# EAGLE design adcdac (EAGLE 6.4)
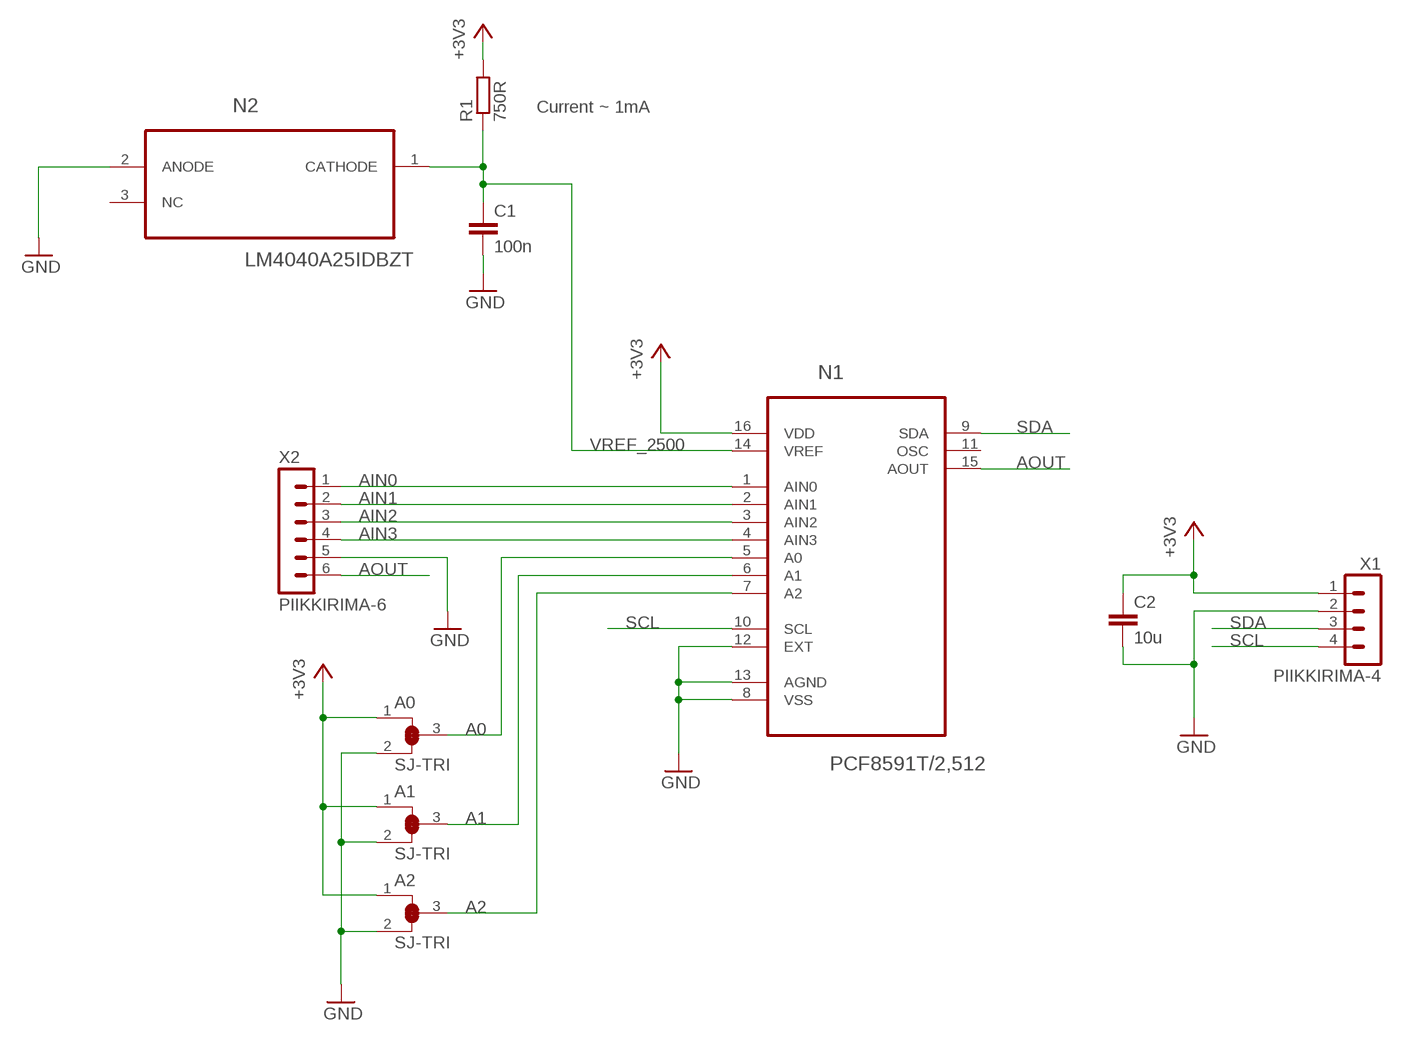
[diagram p0: schematic, sheet 1]

## Parts
A0  SJ-TRI  [SJ-SMALL-TRI]
A1  SJ-TRI  [SJ-SMALL-TRI]
A2  SJ-TRI  [SJ-SMALL-TRI]
C1  100n  C-EUC0603  [C0603]
C2  10u  C-EUC0805  [C0805]
N1  PCF8591T/2,512  [SOIC127P1032X265-16N]
N2  LM4040A25IDBZT  [SOT95P237X112-3N]
R1  750R  R-EU_R0603  [R0603]
X1  PIIKKIRIMA-4  [PIIKKIRIMA-4]
X2  PIIKKIRIMA-6  [PIIKKIRIMA-6]

## Nets
+3V3: A0.1 A1.1 A2.1 C2.1 N1.16(VDD) R1.2 X1.1
A0: A0.3 N1.5(A0)
A1: A1.3 N1.6(A1)
A2: A2.3 N1.7(A2)
AIN0: N1.1(AIN0) X2.1
AIN1: N1.2(AIN1) X2.2
AIN2: N1.3(AIN2) X2.3
AIN3: N1.4(AIN3) X2.4
AOUT: N1.15(AOUT) X2.6
GND: A0.2 A1.2 A2.2 C1.2 C2.2 N1.8(VSS) N1.12(EXT) N1.13(AGND) N2.2(ANODE) X1.2 X2.5
SCL: N1.10(SCL) X1.4
SDA: N1.9(SDA) X1.3
VREF_2500: C1.1 N1.14(VREF) N2.1(CATHODE) R1.1
Unconnected: N1.11(OSC) N2.3(NC)

## Notes on the sheet
- Current ~ 1mA

## Library data of the parts
A0 A1 A2 = OMAT_IC:SJ-TRI
C1 C2 = rcl:C-EU: CAPACITOR, European symbol
N1 = NXP_By_element14_Batch_1:PCF8591T/2,512: 8-bit A/D and D/A converter; MPN: PCF8591T/2,512; OC_FARNELL: 1826767; OC_NEWARK: 70R6911; PACKAGE: SO16; SUPPLIER: NXP
N2 = Texas Instruments_By_element14_Batch_1:LM4040A25IDBZT: PRECISION MICROPOWER SHUNT VOLTAGE REFERENCE; MPN: LM4040A25IDBZT; OC_FARNELL: 1652303; OC_NEWARK: 53K9324; PACKAGE: 3-SOT-23; SUPPLIER: TEXAS INSTRUMENTS
R1 = rcl:R-EU_: RESISTOR, European symbol
X1 = OMAT_IC:PIIKKIRIMA-4
X2 = OMAT_IC:PIIKKIRIMA-6

## Board
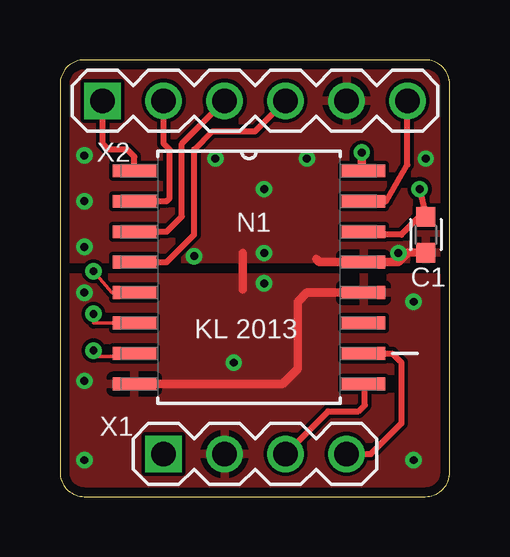
[diagram p1: board, top side]
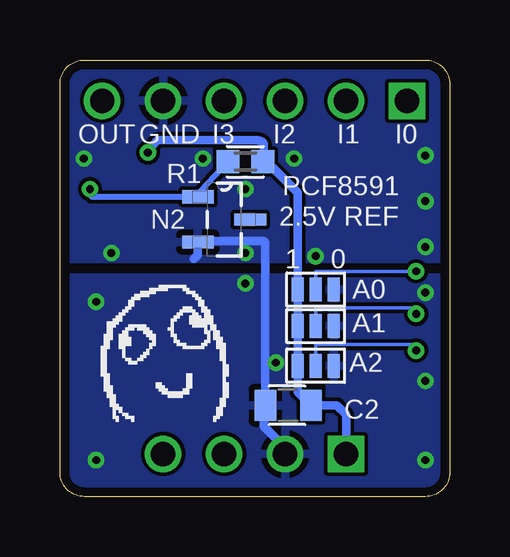
[diagram p2: board, bottom side, seen from below]

Size 16.24 x 18.21 mm. Coordinates in mm from the lower left corner, seen from the top.
Outline: 0,17.2 0,1.02 arc90 1.02,0 15.22,0 arc90 16.24,1.02 16.24,17.2 arc90 15.22,18.21 1.02,18.21 arc90 0,17.2
Copper layers (1*16): Top 0.0356mm / dielectric 1.5011mm / Bottom 0.0356mm
Design rules "LaenPCBOrder": minimum track width 6mil, minimum drill 13mil, track to track 6mil, track to pad 6mil, pad to pad 6mil, via to via 6mil, smd to smd 6mil, copper to edge 15mil, drill to drill 6mil, minimum pad ring 7mil, minimum via ring 7mil, stop-mask expansion 4mil, vias tented up to drill 0mil, thermal gap 10mil

### Footprints (pad centres in the part's own frame; a part is rotated, then mirrored left to right if it is on the bottom)
SJ-SMALL-TRI = smd 0.5 x 1: 1 -0.75,0; 2 0.75,0; 3 0,0
C0603 = smd 0.8 x 0.8: 1 -0.75,0; 2 0.75,0
C0805 = smd 0.9 x 1.3: 1 -0.95,0; 2 0.95,0
SOIC127P1032X265-16N = smd 1.803 x 0.533: 1 -4.775,4.445; 2 -4.775,3.175; 3 -4.775,1.905; 4 -4.775,0.635; 5 -4.775,-0.635; 6 -4.775,-1.905; 7 -4.775,-3.175; 8 -4.775,-4.445; 9 4.775,-4.445; 10 4.775,-3.175; 11 4.775,-1.905; 12 4.775,-0.635; 13 4.775,0.635; 14 4.775,1.905; 15 4.775,3.175; 16 4.775,4.445
SOT95P237X112-3N = smd 1.321 x 0.559: 1 -1.092,0.94; 2 -1.092,-0.94 | smd 1.321 x 0.508: 3 1.092,0
R0603 = smd 0.95 x 0.95: 1 -0.725,0; 2 0.725,0
PIIKKIRIMA-4 = drill 1.016 square: 1 0,0 | drill 1.016: 2 2.54,0; 3 5.08,0; 4 7.62,0
PIIKKIRIMA-6 = drill 1.016 square: 1 0,0 | drill 1.016: 2 2.54,0; 3 5.08,0; 4 7.62,0; 5 10.16,0; 6 12.7,0

### Placement (x,y rotation side)
A0  5.59,8.64 0 bottom
A1  5.59,7.11 0 bottom
A2  5.59,5.46 0 bottom
C1  15.24,10.92 270 top
C2  6.73,3.81 180 bottom
N1  7.87,9.14 0 top
N2  9.4,11.56 0 bottom
R1  8.51,13.97 0 bottom
U$1  [DAFUG]  11.68,5.71 0 bottom
X1  4.32,1.78 0 top
X2  1.78,16.51 0 top

### Tracks (layer width: path | path; a pad name or v marks a point on that pad's centre or on a via)
+3V3  (via drill 0.33)
  Top 0.356: v12.57,14.35 12.57,13.66 N1.16
  Bottom 0.356: X1.1 4.32,3.43 4.7,3.81 C2.1 6.34,4.37 A2.1 A1.1 A0.1 6.34,12.69 7.62,13.97 R1.2 7.75,14.01 7.75,14.73 7.78,14.77 arc-45 8,14.86 12.19,14.86 12.32,14.73 v12.57,14.35
A0  (via drill 0.33)
  Top 0.152: v1.4,9.4 2.16,8.51 N1.5
  Bottom 0.152: A0.3 5.59,9.4 v1.4,9.4
A1  (via drill 0.33)
  Top 0.152: N1.6 1.4,7.24 v1.4,7.62
  Bottom 0.152: v1.4,7.62 1.52,7.87 5.59,7.87 A1.3
A2  (via drill 0.33)
  Top 0.152: v1.4,6.1 1.4,5.84 2.97,5.84 N1.7
  Bottom 0.152: A2.3 5.59,6.35 1.4,6.35 v1.4,6.1
AIN0
  Top 0.254: N1.1 3.1,14.17 2.79,14.48 2.03,14.48 1.78,14.73 X2.1
AIN1
  Top 0.254: N1.2 4.45,12.32 4.57,12.45 4.57,14.48 4.32,14.73 X2.2
AIN2
  Top 0.254: N1.3 4.45,11.05 5.08,11.68 5.08,14.73 X2.3
AIN3
  Top 0.254: N1.4 4.45,9.78 5.59,10.92 5.59,14.48 6.35,15.24 8.13,15.24 X2.4
AOUT
  Top 0.254: N1.15 13.59,12.32 14.48,13.84 X2.6
GND  (via drill 0.33)
  Top 0.356: N1.12 10.29,8.51 9.91,8.13 9.91,5.33 9.27,4.7 N1.8 | C1.2 14.49,10.17 14.1,9.78 N1.13 10.79,9.78 10.67,9.91 | 7.62,10.16 7.62,8.64
  Bottom 0.356: X1.2 6.86,2.03 7.75,2.92 7.75,3.74 C2.2 7.68,10.6 7.75,10.67 10.41,10.67 N2.2 10.49,10.08 10.67,9.91
  other vias: 8.51,8.89 8.51,10.16 1.02,10.41 1.02,12.32 1.02,14.22 15.24,14.1 6.48,14.1 8.51,12.83 14.1,10.16 14.73,8.13 14.73,1.52 1.02,1.52 1.02,8.51 7.24,5.59 1.02,4.83 5.59,10.03 10.29,14.1
  pour Top: -0.13,9.14 16.26,9.14 16.26,0.13 0,0.13 0,9.02
  pour Bottom: -0.13,9.14 16.26,9.14 16.26,0.13 0,0.13 0,9.02
  pour Bottom (rank 2): 0,9.91 0,17.91 16.26,17.91 16.26,11.05 16.38,9.91
  pour Top: 0,17.91 16.26,17.91 16.26,9.91 0,9.91
SCL
  Top 0.254: X1.4 12.95,1.78 14.22,3.05 14.22,5.59 13.84,5.97 N1.10
SDA
  Top 0.254: X1.3 11.18,3.56 12.45,3.56 12.7,3.81 12.7,4.65 N1.9
VREF_2500  (via drill 0.33)
  Top 0.254: v14.99,12.83 C1.1 14.97,11.67 14.22,10.92 12.78,10.92 N1.14
  Bottom 0.254: R1.1 10.38,12.74 N2.1 14.91,12.5 v14.99,12.83

### Text on the board
tPlace: KL 2013
bPlace: I0 | I1 | I2 | I3 | GND | OUT | PCF8591 | 2.5V REF | 0 | 1